# Altium project GPSDO.PrjPCB (part 4 of 4)

## Sheet GPSDO_OCXO.SchDoc: OCXO
size 420 x 297 mm; EDA_Number: ARTIQ; Projet: GPSDO; Author: G.Kasprowicz; CompanyName: WUT ISE; DrawnBy: G.Kasprowicz; Organization: WUT ISE; Address1: PW ISE; Address2: Nowowiejska 15/19 00-665 Warsaw; Address3: gkasprow@gmail.com; Revision: 1; SheetNumber: -; SheetTotal: -; ModifiedBy: -; CheckedDate: -; DivGrp: WUT ISE; Designer: G.Kasprowicz; ModifiedDate: -; ProjectName: Sensor Box
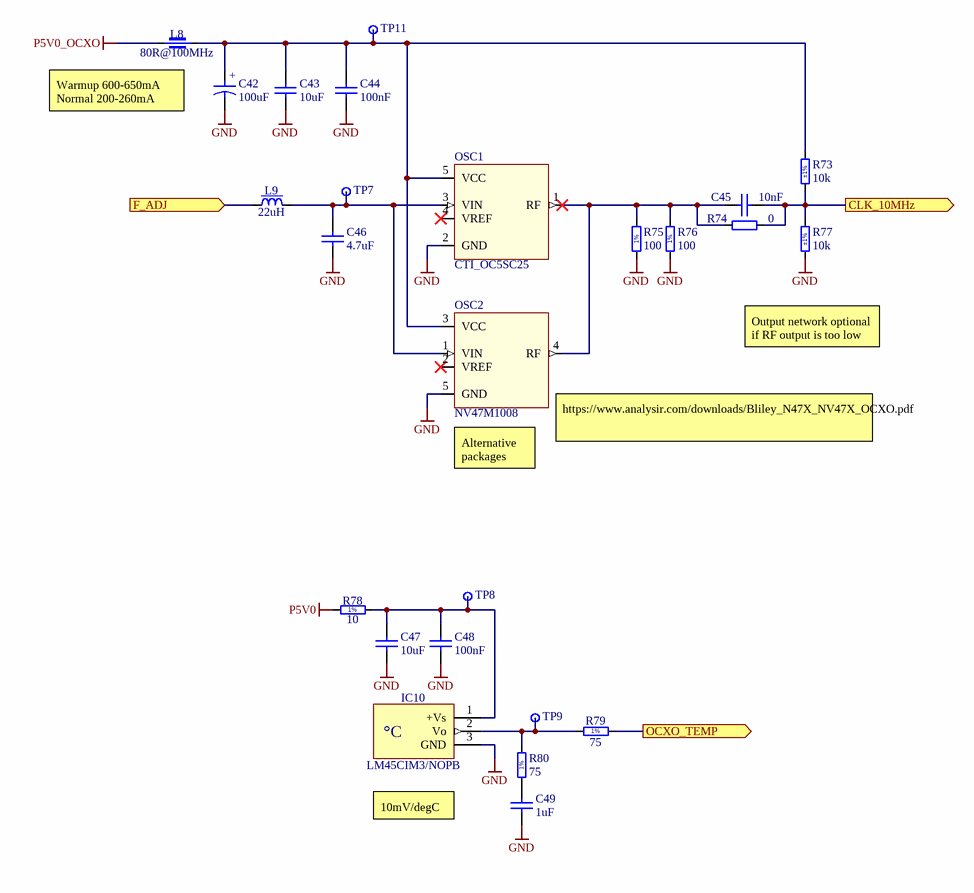
[diagram p7: GPSDO_OCXO.SchDoc]

### Parts
C42  100uF  [CAPMP7343X310N]
C43  10uF  [CAPC1608X80N]
C44  100nF  [CAPC1005X55N]
C45  10nF  [CAPC1005X55N]
C46  4.7uF  [CAPC1709X95N]
C47  10uF  [CAPC1608X80N]
C48  100nF  [CAPC1005X55N]
C49  1uF  [CAPC1005X55N]
IC10  LM45CIM3/NOPB  [SOT95P251X112-3N]
L8  80R@100MHz  [INDC4516X180N]
L9  22uH  [IND_COILCRAFT_0603LS]
OSC1  CTI_OC5SC25  [CTI_OC5SC25]
OSC2  NV47M1008  [BILLEY_NV47M1008]
R73  10k  Tolerance: ±1%  [RESC1005X40N]
R74  0  [RESC1005X40N]
R75  100  [RESC1005X40N]
R76  100  [RESC1005X40N]
R77  10k  Tolerance: ±1%  [RESC1005X40N]
R78  10  [RESC1005X40N]
R79  75  [RESC1005X40N]
R80  75  [RESC1005X40N]
TP7  Test Point  [TPS127]  (value not drawn)  (no BOM)
TP8  Test Point  [TPS127]  (value not drawn)  (no BOM)
TP9  Test Point  [TPS127]  (value not drawn)  (no BOM)
TP11  Test Point  [TPS127]  (value not drawn)  (no BOM)

### Ports
CLK_10MHz (out), F_ADJ (in), OCXO_TEMP (out)

### Nets
GND: C42.2 C43.1 C44.1 C46.1 C47.1 C48.1 C49.1 IC10.3(GND) OSC1.2(GND) OSC2.5(GND) R75.1 R76.1 R77.1
P5V0: R78.1
P5V0_OCXO: L8.1
10MHz: C45.1 R73.1 R74.1 R77.2 ; port CLK_10MHz
A2: R79.2 ; port OCXO_TEMP
F_ADJ: L9.1 ; port F_ADJ
NetC42_1: C42.1 C43.2 C44.2 L8.2 OSC1.5(VCC) OSC2.3(VCC) R73.2 TP11.1
NetC45_2: C45.2 OSC1.1(RF) OSC2.4(RF) R74.2 R75.2 R76.2
NetC46_2: C46.2 L9.2 OSC1.3(VIN) OSC2.1(VIN) TP7.1
NetC47_2: C47.2 C48.2 IC10.1(+Vs) R78.2 TP8.1
NetC49_2: C49.2 R80.1
NetIC10_2: IC10.2(Vo) R79.1 R80.2 TP9.1

Not connected (* = marked no-connect by the designer): OSC1 4(VREF)*; OSC2 2(VREF)*

### Notes on the sheet
- Warmup 600-650mA
  Normal 200-260mA
- Output network optional if RF output is too low
- (near OSC2) Alternative packages
- (near OSC2) https://www.analysir.com/downloads/Bliley_N47X_NV47X_OCXO.pdf
- 10mV/degC
- Project/Equipment
- Document
- Designer
- Drawn by
- Check.by
- Copyright WUT ISE 2020.
  This documentation describes Open Hardware and is licensed under the CERN OHL v.1.2. You may redistribute and modify this documentation under the terms of the CERN OHL v.1.2. (http://ohwr.org/CERNOHL). This documentation is distributed WITHOUT ANY EXPRESS OR IMPLIED WARRANTY, INCLUDING OF MERCHANTABILITY, SATISFACTORY QUALITY AND FITNESS FOR A PARTICULAR PURPOSE. Please see the CERN OHL v.1.2 for applicable conditions.
- Contact
- File
- Last Mod.
- Print Date
- Sheet
- Size
- A3
- of
- Rev
- (in symbol CTE7343-31_100UF_20V_10%) +
- (in symbol LM45CIM3/NOPB) °C
- (in symbol R0402_10R_1%_0.0625W_200PPM) 1%
- (in symbol R0402_75R_1%_0.0625W_100PPM) 1%
- (in symbol R0402_100R_1%_0.0625W_100PPM) 1%

### Library data of the parts
C42 = CTE7343-31_100UF_20V_10%: Polarised capacitor; Part Description: Solid Tantalum Chip Capacitor; Manufacturer: GENERIC; Manufacturer1 Part Number: TAJD107K020R; Voltage: 20V; Tolerance: ±10%; Part Number: CTE7343-31_100UF_20V_10%; Component Kind: Standard; Component Type: Standard; Pin Count: 2; Value: 100uF; Status: Preferred; Manufacturer Part Number: CTE7343-31_100UF_20V_10%; Case: D; Mounted: Yes; Socket: No; SMD: Yes; Sense: No; Manufacturer1 Example: AVX; Manufacturer1 ComponentHeight: 3.1mm; HelpURL: \\cern.ch\dfs\Applications\Altium\Datasheets\CTE_AVX_TAJ.pdf; Author: CERN DEM JLC; CreateDate: 03/12/2007; LatestRevisionDate: 03/12/2007
C43 C47 = CC0603_10UF_10V_10%_X5R: Non-polarised capacitor; Part Description: SMD Multilayer Chip Ceramic Capacitor; Manufacturer: GENERIC; Manufacturer1 Part Number: GRM188R61A106KE69D; Voltage: 10V; TC: X5R; Tolerance: ±10%; Part Number: CC0603_10UF_10V_10%_X5R; Component Kind: Standard; Component Type: Standard; Pin Count: 2; Value: 10uF; Status: None; Manufacturer Part Number: CC0603_10UF_10V_10%_X5R; Case: 0603; Mounted: Yes; Socket: No; SMD: Yes; Sense: No; Manufacturer1 Example: MURATA; Manufacturer1 ComponentHeight: 0.8mm; HelpURL: \\cern.ch\dfs\Applications\Altium\Datasheets\CC0603_MURATA_GRM188R61A106KE69D.pdf; Author: CERN DEM JLC; CreateDate: 31.01.2017; LatestRevisionDate: 31.01.2017
C44 C48 = CC0402_100NF_16V_10%_X5R: Non-polarised capacitor; Part Description: SMD Multilayer Chip Ceramic Capacitor; Manufacturer: GENERIC; Manufacturer1 Part Number: GRM155R61C104KA88D; Voltage: 16V; TC: X5R; Tolerance: ±10%; Part Number: CC0402_100NF_16V_10%_X5R; Component Kind: Standard; Component Type: Standard; Pin Count: 2; Value: 100nF; Status: None; Manufacturer Part Number: CC0402_100NF_16V_10%_X5R; Case: 0402; Mounted: Yes; Socket: No; SMD: Yes; Sense: No; Manufacturer1 Example: MURATA; Manufacturer1 ComponentHeight: 0.55mm; HelpURL: \\cern.ch\dfs\Applications\Altium\Datasheets\CC0402_X5R_MURATA_GRM.pdf; Author: CERN DEM JLC; CreateDate: 10.12.2013; LatestRevisionDate: 10.12.2013
C45 = CC0402_10NF_16V_10%_X7R: Non-polarised capacitor; Part Description: SMD Multilayer Chip Ceramic Capacitor; Manufacturer: GENERIC; Manufacturer1 Part Number: 223878715636; Voltage: 16V; TC: X7R; Tolerance: ±10%; Part Number: CC0402_10NF_16V_10%_X7R; Component Kind: Standard; Component Type: Standard; Pin Count: 2; Value: 10nF; Status: Not Recommended; Manufacturer Part Number: CC0402_10NF_16V_10%_X7R; Case: 0402; Mounted: Yes; Socket: No; SMD: Yes; Sense: No; Manufacturer1 Example: PHYCOMP; Manufacturer1 ComponentHeight: 0.55mm; HelpURL: \\cern.ch\dfs\Applications\Altium\Datasheets\CC0402_X7R_PHYCOMP.pdf; Author: CERN DEM JLC; CreateDate: 2007-12-03; LatestRevisionDate: 2007-12-03
C46 = CC0603_4.7UF_16V_10%_X5R: Non-polarised capacitor; Part Description: SMD Multilayer Chip Ceramic Capacitor; Manufacturer: GENERIC; Manufacturer1 Part Number: EMK107ABJ475KA-T; Voltage: 16V; TC: X5R; Tolerance: ±10%; Part Number: CC0603_4.7UF_16V_10%_X5R; Component Kind: Standard; Component Type: Standard; Pin Count: 2; Value: 4.7uF; Status: None; Manufacturer Part Number: CC0603_4.7UF_16V_10%_X5R; Case: 0603; Mounted: Yes; Socket: No; SMD: Yes; Sense: No; Manufacturer1 Example: TAIYO YUDEN; Manufacturer1 ComponentHeight: 0.95mm; HelpURL: \\cern.ch\dfs\Applications\Altium\Datasheets\CC0603_X7R_TAIYO-YUDEN_HIGH-VALUE.pdf; Author: CERN DEM JLC; CreateDate: 16/12/2013; LatestRevisionDate: 16/09/2014
C49 = CC0402_1UF_16V_10%_X5R: Non-polarised capacitor; Part Description: SMD Multilayer Chip Ceramic Capacitor; Manufacturer: GENERIC; Manufacturer1 Part Number: C1005X5R1C105KT; Voltage: 16V; TC: X5R; Tolerance: ±10%; Part Number: CC0402_1UF_16V_10%_X5R; Component Kind: Standard; Component Type: Standard; Pin Count: 2; Value: 1uF; Status: Preferred; Manufacturer Part Number: CC0402_1UF_16V_10%_X5R; Case: 0402; Mounted: Yes; Socket: No; SMD: Yes; Sense: No; Manufacturer1 Example: TDK; Manufacturer1 ComponentHeight: 0.55mm; HelpURL: \\cern.ch\dfs\Applications\Altium\Datasheets\CC0402_X5R_TDK_C.pdf; Author: CERN DEM JLC; CreateDate: 25.10.2012; LatestRevisionDate: 25.10.2012
IC10 = LM45CIM3/NOPB: -20° to +100°C ±3°C Precision Centigrade Temperature Sensors; Manufacturer: TEXAS INSTRUMENTS; PressFit: No; Bonding: No; Part Number: LM45CIM3/NOPB; Component Kind: Standard; Component Type: Standard; Device: LM45CIM3/NOPB; PackageDescription: SOT, 0.95mm Pitch; 3 Pin, 1.30mm W X 2.92mm L X 1.12mm H body, IPC Medium Density; Part Description: -20° to +100°C ±3°C Precision Centigrade Temperature Sensors; Manufacturer Part Number: LM45CIM3/NOPB; Pin Count: 3; Case: SOT23; Mounted: Yes; Socket: No; SMD: Yes; Sense: No; ComponentHeight: 1.12mm; HelpURL: \\cern.ch\dfs\Applications\Altium\Datasheets\LM45CIM3-NOPB.pdf; Author: CERN DEM JLC; CreateDate: 19/01/2011; LatestRevisionDate: 19/01/2011
L8 = IND1806_MURATA_BLM41PF800SN1L: Part Description: SMD EMI Suppression Chip Ferrite Bead (BLM41P Series); Manufacturer: MURATA; Manufacturer Part Number: BLM41PG750SN1L; Power: 1A; Resistance: 0.1R; Part Number: IND1806_MURATA_BLM41PF800SN1L; Component Kind: Standard; Component Type: Standard; Pin Count: 2; Value: 80R@100MHz; Status: Obsolete; Case: 1806; Mounted: Yes; Socket: No; SMD: Yes; Sense: No; ComponentHeight: 1.8mm; HelpURL: \\cern.ch\dfs\Applications\Altium\Datasheets\IND1806_MURATA_BLM41PF800SN1L.pdf; Author: CERN DEM JLC; CreateDate: 14/05/2018; LatestRevisionDate: 14/05/2018
L9 = IND_22UH_5%_COILCRAFT_0603LS: Inductor With Core; Part Description: SMT Chip Inductor; Manufacturer Part Number: 0603LS-223XJL; Power: 130mA; Resistance: 8.81R; Tolerance: ±5%; Part Number: IND_22UH_5%_COILCRAFT_0603LS; Component Kind: Standard; Component Type: Standard; Pin Count: 2; Value: 22uH; Status: None; Manufacturer: COILCRAFT; Case: 0603; Mounted: Yes; Socket: No; SMD: Yes; Sense: No; ComponentHeight: 1.12mm; HelpURL: \\cern.ch\dfs\Applications\Altium\Datasheets\IND_COILCRAFT_0603LS.pdf; Author: CERN DEM MR; CreateDate: 01/10/2019; LatestRevisionDate: 01/10/2019
OSC1 = CTI_OC5SC25: Manufacturer: CTI; Device: CTI_OC5SC25; Manufacturer Part Number: OC5SC25; Part Number: OC5SC25
OSC2 = BILLEY_NV47M1008: Manufacturer: Billey; Device: NV47M1008; Manufacturer Part Number: NV47M1008; Datasheet: https://www.analysir.com/downloads/Bliley_N47X_NV47X_OCXO.pdf
R73 R77 = R0402_10K_1%_0.0625W_100PPM: Resistor - 1%; Part Description: General Purpose Thick Film Chip Resistor; Manufacturer: GENERIC; Manufacturer1 Part Number: 232270671003L; TC: ±100ppm/°C; PressFit: No; Part Number: R0402_10K_1%_0.0625W_100PPM; Component Kind: Standard; Component Type: Standard; Pin Count: 2; Value: 10k; Status: Not Recommended; Power: 0.0625W; Manufacturer Part Number: R0402_10K_1%_0.0625W_100PPM; Case: 0402; Mounted: Yes; Sense: No; Socket: No; SMD: Yes; Manufacturer1 Example: YAGEO PHYCOMP; Manufacturer1 ComponentHeight: 0.4mm; HelpURL: \\cern.ch\dfs\Applications\Altium\Datasheets\R0402_Phycomp_RC0402.pdf; Author: CERN DEM JLC; CreateDate: 03.12.2007; LatestRevisionDate: 17.10.2012
R74 = R0402_0R_JUMPER: Resistor; Part Description: 1A (0.05R Max DC Resistance) Zero Ohm Jumper; Manufacturer: GENERIC; Manufacturer1 Part Number: 232270591001L; PressFit: No; Part Number: R0402_0R_JUMPER; Component Kind: Standard; Component Type: Standard; Pin Count: 2; Value: 0; Status: Not Recommended; Manufacturer Part Number: R0402_0R_JUMPER; Case: 0402; Mounted: Yes; Socket: No; SMD: Yes; Manufacturer1 Example: YAGEO PHYCOMP; Manufacturer1 ComponentHeight: 0.4mm; HelpURL: \\cern.ch\dfs\Applications\Altium\Datasheets\R0402_Phycomp_RC0402.pdf; Author: CERN DEM JLC; CreateDate: 03.12.2007; LatestRevisionDate: 17.10.2012; Sense: No
R75 R76 = R0402_100R_1%_0.0625W_100PPM: Resistor - 1%; Part Description: General Purpose Thick Film Chip Resistor; Manufacturer: GENERIC; Manufacturer1 Part Number: 232270671001L; TC: ±100ppm/°C; PressFit: No; Part Number: R0402_100R_1%_0.0625W_100PPM; Component Kind: Standard; Component Type: Standard; Pin Count: 2; Value: 100; Status: Not Recommended; Power: 0.0625W; Tolerance: ±1%; Manufacturer Part Number: R0402_100R_1%_0.0625W_100PPM; Case: 0402; Mounted: Yes; Sense: No; Socket: No; SMD: Yes; Manufacturer1 Example: YAGEO PHYCOMP; Manufacturer1 ComponentHeight: 0.4mm; HelpURL: \\cern.ch\dfs\Applications\Altium\Datasheets\R0402_Phycomp_RC0402.pdf; Author: CERN DEM JLC; CreateDate: 03.12.2007; LatestRevisionDate: 17.10.2012
R78 = R0402_10R_1%_0.0625W_200PPM: Resistor - 1%; Part Description: General Purpose Thick Film Chip Resistor; Manufacturer: GENERIC; Manufacturer1 Part Number: 232270671009L; TC: ±200ppm/°C; PressFit: No; Part Number: R0402_10R_1%_0.0625W_200PPM; Component Kind: Standard; Component Type: Standard; Pin Count: 2; Value: 10; Status: Not Recommended; Power: 0.0625W; Tolerance: ±1%; Manufacturer Part Number: R0402_10R_1%_0.0625W_200PPM; Case: 0402; Mounted: Yes; Sense: No; Socket: No; SMD: Yes; Manufacturer1 Example: YAGEO PHYCOMP; Manufacturer1 ComponentHeight: 0.4mm; HelpURL: \\cern.ch\dfs\Applications\Altium\Datasheets\R0402_Phycomp_RC0402.pdf; Author: CERN DEM JLC; CreateDate: 24/06/2009; LatestRevisionDate: 17/10/2012
R79 R80 = R0402_75R_1%_0.0625W_100PPM: Resistor - 1%; Part Description: General Purpose Thick Film Chip Resistor; Manufacturer: GENERIC; Manufacturer1 Part Number: 232270677509L; TC: ±100ppm/°C; PressFit: No; Part Number: R0402_75R_1%_0.0625W_100PPM; Component Kind: Standard; Component Type: Standard; Pin Count: 2; Value: 75; Status: Not Recommended; Power: 0.0625W; Tolerance: ±1%; Manufacturer Part Number: R0402_75R_1%_0.0625W_100PPM; Case: 0402; Mounted: Yes; Sense: No; Socket: No; SMD: Yes; Manufacturer1 Example: YAGEO PHYCOMP; Manufacturer1 ComponentHeight: 0.4mm; HelpURL: \\cern.ch\dfs\Applications\Altium\Datasheets\R0402_Phycomp_RC0402.pdf; Author: CERN DEM JLC; CreateDate: 03/12/2007; LatestRevisionDate: 17/10/2012
TP7-TP9 TP11 = SMD_PAD_1.27X1.27MM: Part Description: 1.27mm x 1.27mm PCB Copper Area (SMD Test Point); Mounted: No; Part Number: SMD_PAD_1.27X1.27MM; Component Type: Standard (No BOM); Pin Count: 1; Family: Test Point; Socket: No; SMD: Yes; Sense: No; Status: None; ComponentHeight: 0mm; HelpURL: Undefined; Author: CERN DEM JLC; CreateDate: 12.01.2008; LatestRevisionDate: 12.01.2008; PackageDescription: 1.27mm x 1.27mm PCB Copper Area (SMD Test Point)

## Nets that join several sheets
GND: GPSDO (41 pins), GPSDO_Heater (21 pins), GPSDO_Controller (18 pins), GPSDO_Arduino (32 pins), GPSDO_Supply (45 pins), GPSDO_GPS (12 pins), GPSDO_DAC (9 pins), GPSDO_OCXO (13 pins)
P3V3: GPSDO (C91.2 IC8.1), GPSDO_Controller (8 pins), GPSDO_Supply (C76.1 IC16.5 TP16.1), GPSDO_GPS (L2.1)
P5V0: GPSDO (L5.1 R41.1), GPSDO_Heater (C54.2 C55.2 IC11.1 TP12.1), GPSDO_Controller (L3.1 L4.1), GPSDO_Supply (R152.2), GPSDO_OCXO (R78.1)
P5V0_OCXO: GPSDO_Supply (R151.2), GPSDO_OCXO (L8.1)
P8V0: GPSDO_Controller (C11.1), GPSDO_Arduino (C38.2 C39.2 IC7.2 R70.2), GPSDO_Supply (10 pins)
P12V0: GPSDO (J5.23 J5.24 J5.25 R59.1), GPSDO_Heater (C58.2 C59.2 IC12.5 L10.1), GPSDO_Supply (16 pins)
Vref: GPSDO_Heater (R122.2), GPSDO_Supply (C79.2 C80.2 IC17.6 TP17.1), GPSDO_DAC (6 pins)
10MHz: GPSDO (6 pins), GPSDO_Controller (IC2.1), GPSDO_OCXO (C45.1 R73.1 R74.1 R77.2)
A0: GPSDO_Controller (C7.2 R13.1 R18.2), GPSDO_Arduino (U1.36)
A1: GPSDO_Heater (IC11.2 R109.1 R112.2 TP19.1), GPSDO_Arduino (U1.37)
A2: GPSDO_Arduino (U1.38), GPSDO_OCXO (R79.2)
A3: GPSDO (R45.2), GPSDO_Arduino (U1.39)
A4: GPSDO_Controller (R10.1), GPSDO_Arduino (U1.40)
A5: GPSDO_Controller (R9.1), GPSDO_Arduino (U1.41)
CAP_Decharge: GPSDO_Controller (R18.1), GPSDO_Arduino (U1.30)
D2: GPSDO (R53.1 R54.1), GPSDO_Arduino (U1.19)
D4: GPSDO_Controller (R52.2), GPSDO_Arduino (U1.25)
D5: GPSDO_Controller (R11.2), GPSDO_Arduino (U1.31)
D7: GPSDO_Arduino (U1.1), GPSDO_DAC (IC4.6 R30.1)
D8: GPSDO_Controller (R15.2), GPSDO_Arduino (U1.28)
D9: GPSDO_Arduino (U1.29), GPSDO_DAC (IC4.7 R29.1)
D11: GPSDO_Arduino (U1.12), GPSDO_DAC (IC4.5)
D12: GPSDO_Controller (R19.2), GPSDO_Arduino (U1.26)
D13: GPSDO (R55.1 R56.1), GPSDO_Arduino (U1.32)
D14: GPSDO (J5.20), GPSDO_Arduino (CON1.1 U1.11)
D15: GPSDO (J5.21), GPSDO_Arduino (CON1.3 U1.9)
F_ADJ: GPSDO_DAC (J10.2 R57.1 R58.2), GPSDO_OCXO (L9.1)
GPS_ANT: GPSDO (J3.1), GPSDO_GPS (D1.1 L1.2 R1.1)
GPS_RXD_3V3: GPSDO_Controller (R20.1 T3.2), GPSDO_GPS (R7.1)
GPS_TXD_3V3: GPSDO_Controller (R22.1 T4.2), GPSDO_GPS (R8.1)
NANO_RSTn: GPSDO_Controller (J1.1), GPSDO_Arduino (CON1.5 R69.2 U1.13)
NANO_RXD_3V3: GPSDO (J5.17), GPSDO_Controller (R24.1 T1.2)
NANO_TXD_3V3: GPSDO (J5.18), GPSDO_Controller (R26.1 T2.2)
PPS: GPSDO (IC8.2 R27.2), GPSDO_Controller (IC3.14 R15.1 R52.1), GPSDO_GPS (IC1.3)

## Assembly variants
Default: not fitted C6 C45 C68 C69 C70 CON1 D3 IC14 J11 OSC2 R3 R11 R12 R14 R15 R17 R57 R58 R61 R73 R75 R76 R146 R148 R149 R150 TR1 TR2 TR3